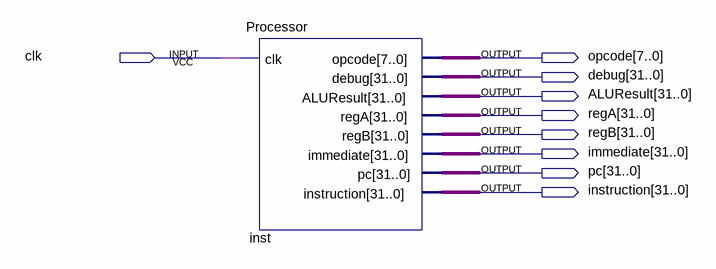
[diagram p0: schematic sheet]
// Quartus schematic quanta2.bdf as structural Verilog: 1 symbols, 9 pins
module quanta2 (
  input  clk,
  output [7:0] opcode,
  output [31:0] debug,
  output [31:0] ALUResult,
  output [31:0] regA,
  output [31:0] regB,
  output [31:0] immediate,
  output [31:0] pc,
  output [31:0] instruction
);

  Processor inst (
    .clk(clk), .opcode(opcode), .debug(debug), .ALUResult(ALUResult), .regA(regA), .regB(regB),
    .immediate(immediate), .pc(pc), .instruction(instruction));
endmodule
